# EAGLE schematic medium_h220 (EAGLE 5.07)
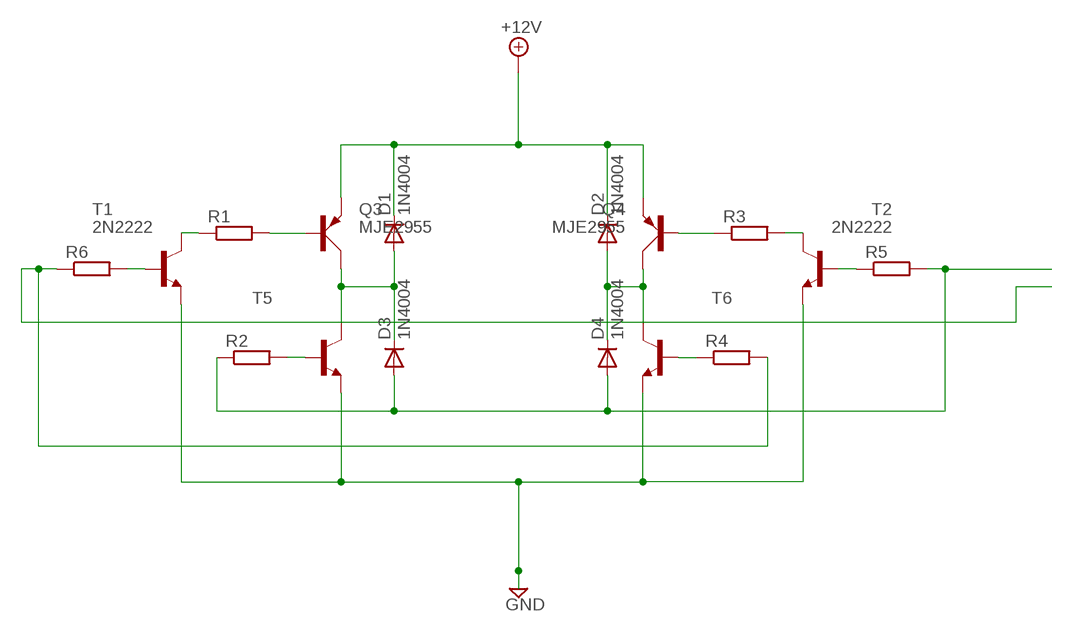
[diagram p0: schematic, sheet 1]

## Parts
D1  1N4004  [DO41-10]
D2  1N4004  [DO41-10]
D3  1N4004  [DO41-10]
D4  1N4004  [DO41-10]
Q3  MJE2955  [TO220AV]
Q4  MJE2955  [TO220AV]
R1  R-EU_0204/5  [0204/5]
R2  R-EU_0204/5  [0204/5]
R3  R-EU_0204/5  [0204/5]
R4  R-EU_0204/5  [0204/5]
R5  R-EU_0204/5  [0204/5]
R6  R-EU_0204/5  [0204/5]
T1  2N2222  [TO18]
T2  2N2222  [TO18]
T5  -NPN-TO220V  [TO220V]
T6  -NPN-TO220V  [TO220V]

## Nets
+12V: D1.C D2.C Q3.E Q4.E
GND: T1.1(E) T2.1(E) T5.3(E) T6.3(E)
N$1: R1.1 T1.3(C)
N$2: Q3.B R1.2
N$3: D2.A D4.C Q4.C T6.2(C)
N$6: R4.2 R6.1
N$7: R4.1 T6.1(B)
N$8: Q4.B R3.1
N$9: R2.2 T5.1(B)
N$10: R6.2 T1.2(B)
N$11: R5.1 T2.2(B)
N$12: R3.2 T2.3(C)
N$13: D1.A D3.C Q3.C T5.2(C)
N$15: D3.A D4.A R2.1 R5.2

## Library data of the parts
D1-D4 = diode:1N4004: DIODE general purpose rectifier, 1 A
Q3 Q4 = transistor-power:MJE2955: PNP TRANSISTOR
R1-R6 = rcl:R-EU_: RESISTOR, European symbol
T1 T2 = transistor:2N2222: NPN TRANSISTOR
T5 T6 = transistor-neu-to92:*-NPN-: NPN Transistror